# Altium project JacdacBrainNRF 57.PrjPCB
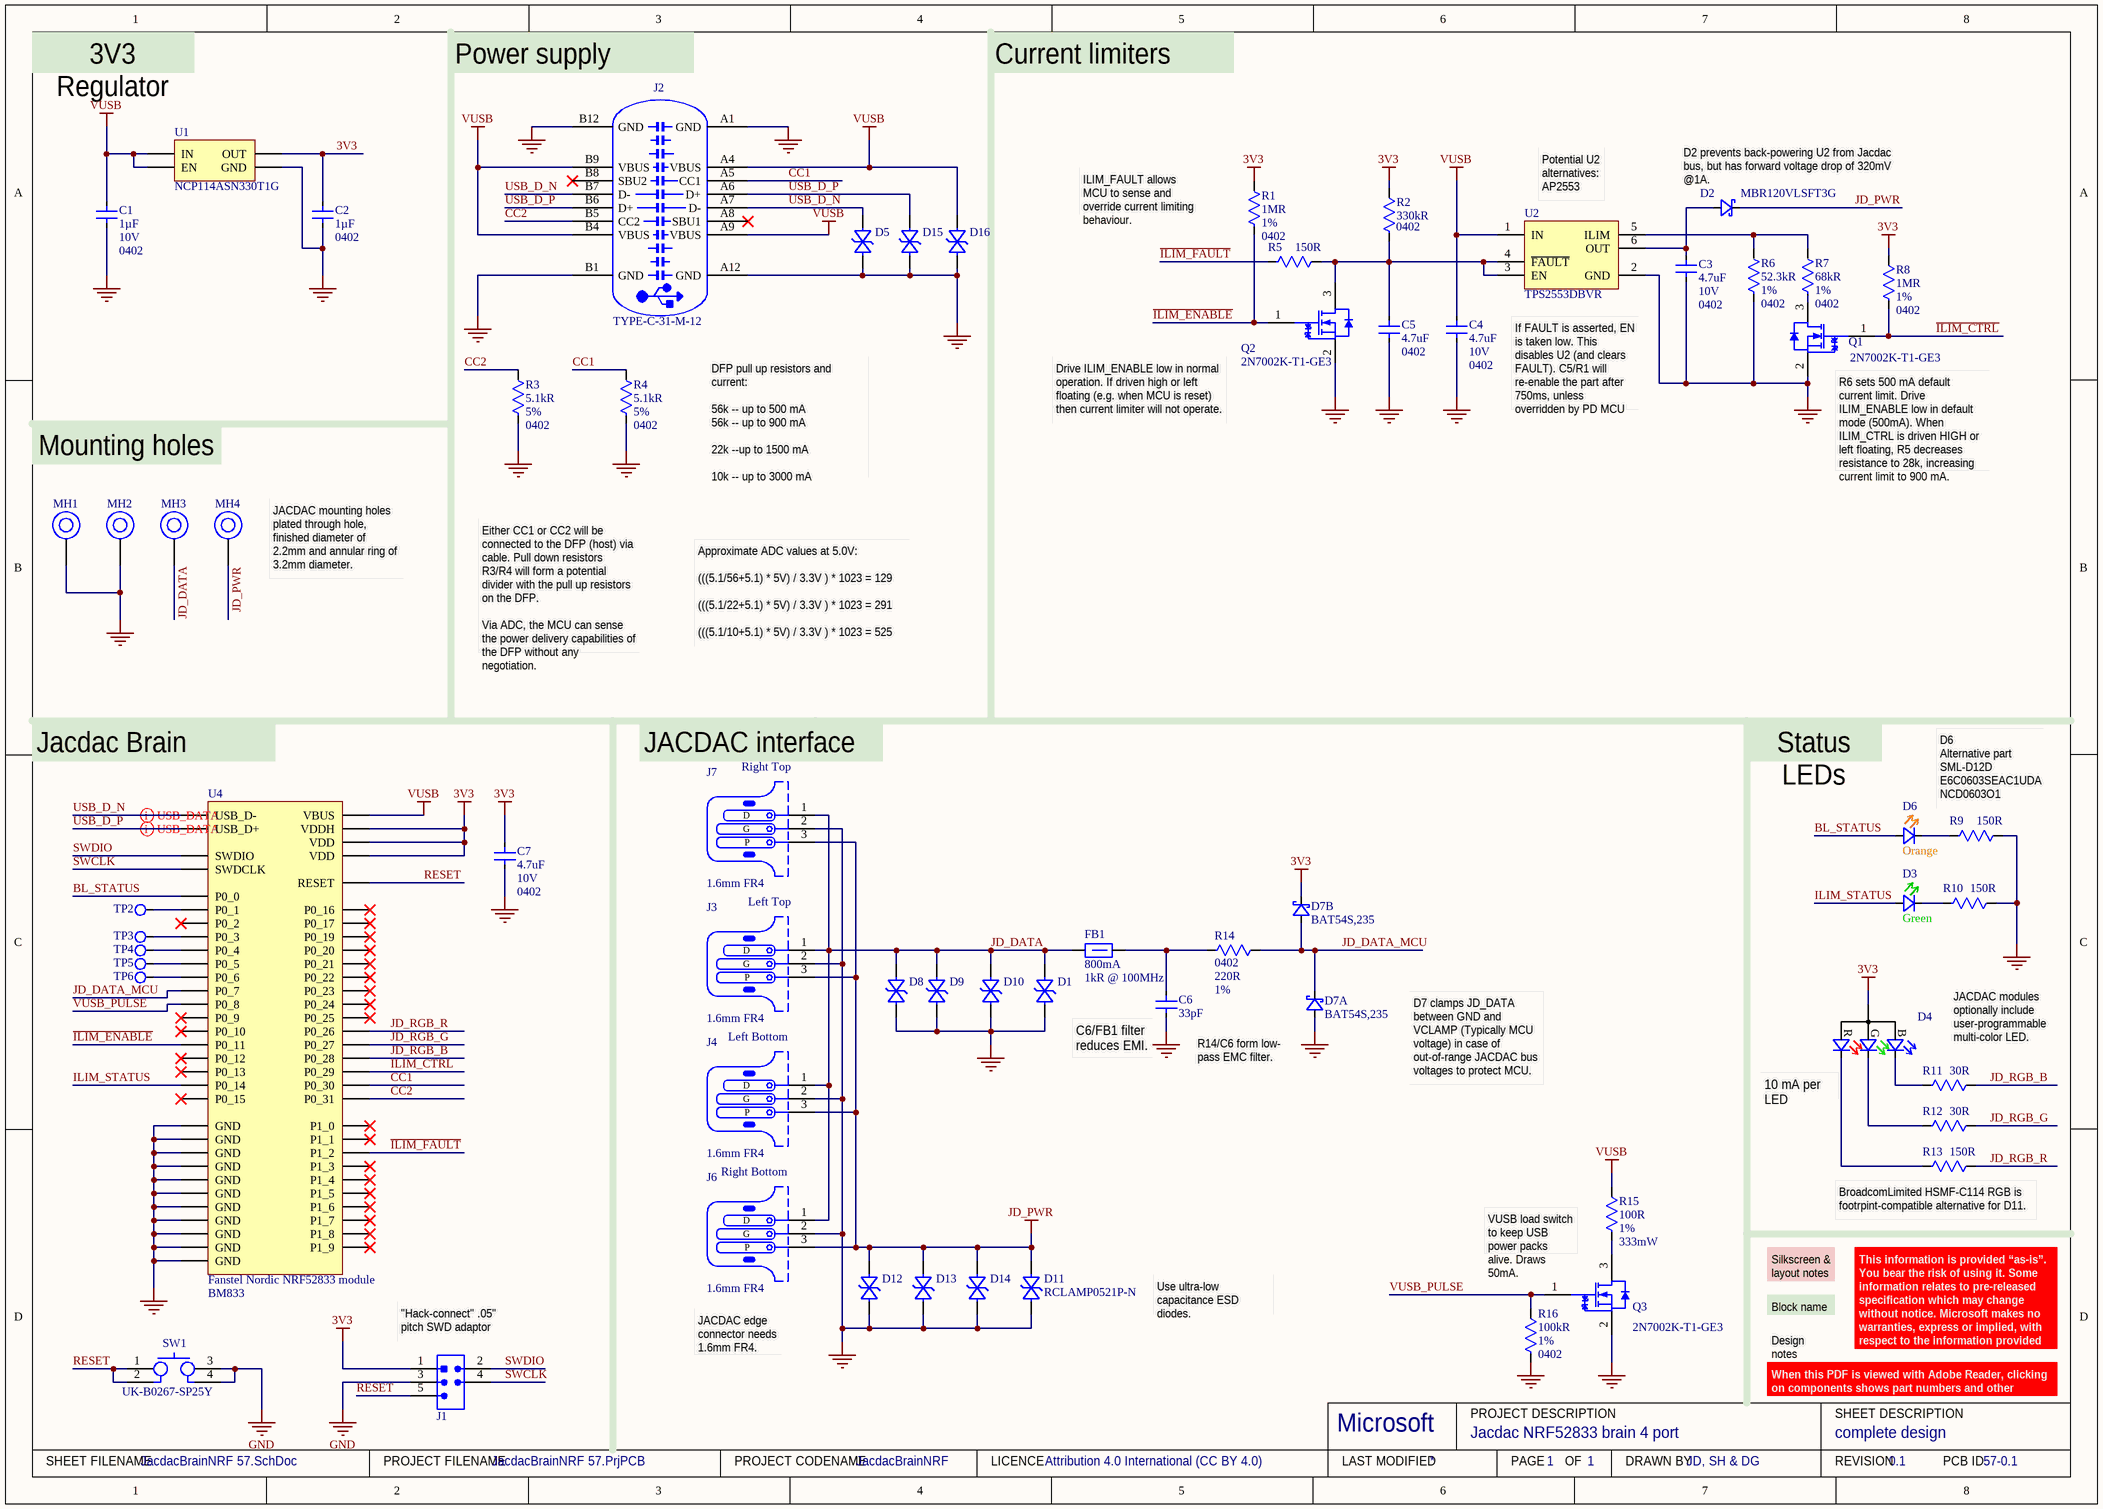
[diagram p0: JacdacBrainNRF 57.SchDoc]
ProjectCodeName: JacdacBrainNRF; ProjectCodenameDescription: Jacdac NRF52833 brain 4 port; ProjectCodenameID: 57; ProjectDrawnBy: JD, SH & DG; ProjectLicenceTerms: Attribution 4.0 International (CC BY 4.0); ProjectRevision: 0.1
1 sheet, 62 parts. Net scope: global (net labels, ports and power ports of the same name join across sheets).
Board files: JacdacBrainNRF 57.PcbDoc, Panelized JacdacBrainNRF 57.PcbDoc

## Sheet JacdacBrainNRF 57.SchDoc: complete design
size A3; DrawnBy: JD, SH & DG; DocumentNumber: 1; Revision: 0.1; SheetNumber: 1; SheetTotal: 1; VersionControl_RevNumber: 1

### Parts
C1  Capacitance: 1µF  Voltage Rating: 10V  Case Code (Imperial): 0402  [C0402_0.55MM - without outline]  (hidden comment: CL05A105KP5NNNC)
C2  Capacitance: 1µF  Case Code (Imperial): 0402  [C0402_0.55MM - without outline]  (hidden comment: CL05A105KP5NNNC)
C3  Capacitance: 4.7uF  Voltage Rating: 10V  Case Code (Imperial): 0402  [R0402 - Without outline]  (hidden comment: CL05A475MP5NRNC)
C4  Capacitance: 4.7uF  Voltage Rating: 10V  Case Code (Imperial): 0402  [R0402 - Without outline]  (hidden comment: CL05A475MP5NRNC)
C5  Capacitance: 4.7uF  Case Code (Imperial): 0402  [R0402 - Without outline]  (hidden comment: CL05A475MP5NRNC)
C6  Capacitance: 33pF  [C0402_0.55MM - without outline]  (hidden comment: CL05C330JB51PNC)
C7  Capacitance: 4.7uF  Voltage Rating: 10V  Case Code (Imperial): 0402  [R0402 - Without outline]  (hidden comment: CL05A475MP5NRNC)
D1  RCLAMP0521P-N  [TVS 0402 - L]  (value not drawn)
D2  MBR120VLSFT3G  [MBR120VLSFT3G]
D3  Colour: Green  [0603 Green]  (hidden comment: 19-217/GHC-YR1S2/3T)
D4  TZ-P4-1615RGBTCA1-0.55T  [TZ-P4-1615RGBTCA1-0.55T]  (value not drawn)
D5  RCLAMP0521P-N  [TVS 0402 - L]  (value not drawn)
D6  Colour: Orange  [0603 Orange]  (hidden comment: 19-217/S2C-AQ1R1B/3T)
D7  Manufacturer Part Number: BAT54S,235  [NXP-BAT54S-TO-236AB]  (hidden comment: BAT54S)  (parts A,B of 2)
D8  RCLAMP0521P-N  [TVS 0402 - L]  (value not drawn)
D9  RCLAMP0521P-N  [TVS 0402 - L]  (value not drawn)
D10  RCLAMP0521P-N  [TVS 0402 - L]  (value not drawn)
D11  RCLAMP0521P-N  [TVS 0402 - L]
D12  RCLAMP0521P-N  [TVS 0402 - L]  (value not drawn)
D13  RCLAMP0521P-N  [TVS 0402 - L]  (value not drawn)
D14  RCLAMP0521P-N  [TVS 0402 - L]  (value not drawn)
D15  RCLAMP0521P-N  [TVS 0402 - L]  (value not drawn)
D16  RCLAMP0521P-N  [TVS 0402 - L]  (value not drawn)
FB1  Current Rating: 800mA  Impedance: 1kR @ 100MHz  [TDK MPZ1608 0.8mm - without outline]  (hidden comment: TDK MPZ1608S102ATA00)
J1  Hack Connect Mini 1.27 mm pitch 2-row  [HACK_CONNECT_MINI_5_X_1_27]  (value not drawn)  (no BOM)
J2  TYPE-C-31-M-12  [TYPE-C-31-M-12]
J3  PCB Type: 1.6mm FR4  [JACDAC_EDGE_CONNECTOR_NO_TRACES]  (hidden comment: 3 pin JACDAC edge connector)  (no BOM)
J4  PCB Type: 1.6mm FR4  [JACDAC_EDGE_CONNECTOR_NO_TRACES]  (hidden comment: 3 pin JACDAC edge connector)  (no BOM)
J6  PCB Type: 1.6mm FR4  [JACDAC_EDGE_CONNECTOR_NO_TRACES]  (hidden comment: 3 pin JACDAC edge connector)  (no BOM)
J7  PCB Type: 1.6mm FR4  [JACDAC_EDGE_CONNECTOR_NO_TRACES]  (hidden comment: 3 pin JACDAC edge connector)  (no BOM)
MH1  MH_5.0MMK_3.0MMC_2.1MMD_PTH  [MH_5.0MMK_3.0MMC_2.1MMD_PTH]  (value not drawn)  (no BOM)
MH2  MH_5.0MMK_3.0MMC_2.1MMD_PTH  [MH_5.0MMK_3.0MMC_2.1MMD_PTH]  (value not drawn)  (no BOM)
MH3  MH_5.0MMK_3.0MMC_2.1MMD_PTH  [MH_5.0MMK_3.0MMC_2.1MMD_PTH]  (value not drawn)  (no BOM)
MH4  MH_5.0MMK_3.0MMC_2.1MMD_PTH  [MH_5.0MMK_3.0MMC_2.1MMD_PTH]  (value not drawn)  (no BOM)
Q1  2N7002K-T1-GE3  [SOT-23-3 (TO-236)]
Q2  2N7002K-T1-GE3  [SOT-23-3 (TO-236)]
Q3  2N7002K-T1-GE3  [SOT-23-3 (TO-236)]
R1  Resistance: 1MR  Tolerance: 1%  Case Code (Imperial): 0402  [R0402 - Without outline]
R2  Resistance: 330kR  Size Code: 0402  [R0402 - Without outline]  (hidden comment: RC0402FR-07330KL)
R3  Resistance: 5.1kR  Tolerance: 5%  Case Code (Imperial): 0402  [R0402 - Without outline]  (hidden comment: RC0402JR-075K1L)
R4  Resistance: 5.1kR  Tolerance: 5%  Case Code (Imperial): 0402  [R0402 - Without outline]  (hidden comment: RC0402JR-075K1L)
R5  Resistance: 150R  [R0402 - Without outline]  (hidden comment: RC0402FR-07150RL)
R6  Resistance: 52.3kR  Tolerance: 1%  Case Code (Imperial): 0402  [R0402 - Without outline]  (hidden comment: RC0402FR-0752K3L)
R7  Resistance: 68kR  Tolerance: 1%  Case Code (Imperial): 0402  [R0402 - Without outline]  (hidden comment: RT0402FRE0768KL)
R8  Resistance: 1MR  Tolerance: 1%  Case Code (Imperial): 0402  [R0402 - Without outline]
R9  Resistance: 150R  [R0402 - Without outline]  (hidden comment: RC0402FR-07150RL)
R10  Resistance: 150R  [R0402 - Without outline]  (hidden comment: RC0402FR-07150RL)
R11  Resistance: 30R  [R0402 - Without outline]  (hidden comment: RC0402FR-0730RL)
R12  Resistance: 30R  [R0402 - Without outline]  (hidden comment: RC0402FR-0730RL)
R13  Resistance: 150R  [R0402 - Without outline]  (hidden comment: RC0402FR-07150RL)
R14  Case Code (Imperial): 0402  Resistance: 220R  Tolerance: 1%  [R0402 - Without outline]  (hidden comment: RC0402FR-07220RL)
R15  Resistance: 100R  Tolerance: 1%  Max Power Dissipation: 333mW  [RES0805]  (hidden comment: CRGP0805F100R)
R16  Resistance: 100kR  Tolerance: 1%  Case/Package: 0402  [R0402 - Without outline]  (hidden comment: RC0402FR-07100KL)
SW1  UK-B0267-SP25Y  [USAKRO-UK-B0267-SP25Y]
TP2  TestPoint  [Pad1.27mm]  (value not drawn)  (no BOM)
TP3  TestPoint  [Pad1.27mm]  (value not drawn)  (no BOM)
TP4  TestPoint  [Pad1.27mm]  (value not drawn)  (no BOM)
TP5  TestPoint  [Pad1.27mm]  (value not drawn)  (no BOM)
TP6  TestPoint  [Pad1.27mm]  (value not drawn)  (no BOM)
U1  LDO 3.3V/300 mA  [ON_SEMI-SOT23-5 - without outline]  (value not drawn)
U2  TPS2553DBVR  [TI-TPS2553]
U4  Fanstel Nordic NRF52833 module  [BM833]

### Nets
3V3: C2.2 C7.2 D4.1(A) D7.2(K) J1.1(VCC) R1.1 R2.1 R8.1 U1.5(OUT) U4.14(VDD) U4.28(VDD) U4.56(VDDH)
GND: C1.1 C2.1 C3.1 C4.1 C5.1 C6.1 C7.1 D1.2(A) D5.2(A) D7.1(A) D8.2(A) D9.2(A) D10.2(A) D11.2(A) D12.2(A) D13.2(A) D14.2(A) D15.2(A) D16.2(A) J1.3(GND) J2.A1(GND) J2.A12(GND) J2.B1(GND) J2.B12(GND) J3.2(G) J4.2(G) J6.2(G) J7.2(G) MH1.1 MH2.1 Q1.2(S) Q2.2(S) Q3.2(S) R3.2 R4.2 R6.1 R9.2 R10.2 R16.1 SW1.3 SW1.4 U1.2(GND) U2.2(GND) U4.1(GND) U4.2(GND) U4.3(GND) U4.4(GND) U4.5(GND) U4.13(GND) U4.15(GND) U4.18(GND) U4.19(GND) U4.30(GND) U4.45(GND)
JD_PWR: D2.1(K) D11.1(K) D12.1(K) D13.1(K) D14.1(K) J3.3(P) J4.3(P) J6.3(P) J7.3(P) MH4.1
VUSB: C1.2 C4.2 D16.1(K) J2.A4(VBUS) J2.A9(VBUS) J2.B4(VBUS) J2.B9(VBUS) R15.2 U1.1(IN) U1.3(EN) U2.1(IN) U4.58(VBUS)
~{ILIM_CTRL}: Q1.1(G) R8.2 U4.10(P0_29)
~{ILIM_ENABLE}: Q2.1(G) R1.2 U4.34(P0_11)
~{ILIM_FAULT}: R5.1 U4.32(P1_2)
BL_STATUS: D6.2(A) U4.16(P0_0)
CC1: J2.A5(CC1) R4.1 U4.11(P0_30)
CC2: J2.B5(CC2) R3.1 U4.12(P0_31)
ILIM_STATUS: D3.2(A) U4.33(P0_14)
JD_DATA: D1.1(K) D8.1(K) D9.1(K) D10.1(K) FB1.1 J3.1(D) J4.1(D) J6.1(D) J7.1(D) MH3.1
JD_DATA_MCU: D7.3(K) R14.1 U4.24(P0_7)
JD_RGB_B: R11.2 U4.9(P0_28)
JD_RGB_G: R12.2 U4.8(P0_27)
JD_RGB_R: R13.2 U4.7(P0_26)
RESET: J1.5(RESET) SW1.1 SW1.2 U4.40(RESET)
SWCLK: J1.4(SWCLK) U4.42(SWDCLK)
SWDIO: J1.2(SWDIO) U4.43(SWDIO)
USB_D_N: D5.1(K) J2.A7(D-) J2.B7(D-) U4.68(USB_D-)
USB_D_P: D15.1(K) J2.A6(D+) J2.B6(D+) U4.67(USB_D+)
VUSB_PULSE: Q3.1(G) R16.2 U4.27(P0_8)
NetC3_2: C3.2 D2.2(A) U2.6(OUT)
NetC5_2: C5.2 Q2.3(D) R2.2 R5.2 U2.3(EN) U2.4(~{FAULT})
NetC6_2: C6.2 FB1.2 R14.2
NetD3_1: D3.1(K) R10.1
NetD4_2: D4.2(R) R13.1
NetD4_3: D4.3(G) R12.1
NetD4_4: D4.4(B) R11.1
NetD6_1: D6.1(K) R9.1
NetQ1_3: Q1.3(D) R7.1
NetQ3_3: Q3.3(D) R15.1
NetR6_2: R6.2 R7.2 U2.5(ILIM)
NetTP2_1: TP2.1 U4.17(P0_1)
NetTP3_1: TP3.1 U4.20(P0_3)
NetTP4_1: TP4.1 U4.21(P0_4)
NetTP5_1: TP5.1 U4.23(P0_5)
NetTP6_1: TP6.1 U4.25(P0_6)

Not connected (* = marked no-connect by the designer): J2 A8(SBU1)* B8(SBU2)*; U4 22(P0_2)* 26(P0_9)* 29(P0_10)* 31(P1_1)* 35(P0_15)* 36(P0_16)* 37(P0_17)* 38(P1_0)* 41(P0_13)* 44(P0_22)* 47(P0_24)* 48(P0_19)* 49(P1_3)* 51(P1_5)* 52(P1_9)* 53(P0_23)* 54(P1_8)* 55(P0_25)* 60(P0_21)* 61(P1_4)* 62(P0_20)* 64(P0_12)* 65(P1_6)* 66(P1_7)*

### Layout directives
differential pair; rule Signal Stimulus [Kind - Single Pulse    Level - High    Start Time = 0.000    Stop Time = 41.67n    Period Time = 83.33n]: USB_D_N
differential pair; rule Signal Stimulus [Kind - Single Pulse    Level - High    Start Time = 0.000    Stop Time = 500.0m    Period Time = 1.000]: USB_D_P

### Notes on the sheet
- 3V3 Regulator
- Power supply
- Current limiters
- (near D2) D2 prevents back-powering U2 from Jacdac bus, but has forward voltage drop of 320mV @1A.
- (near R1) ILIM_FAULT allows MCU to sense and override current limiting behaviour.
- (near U2) Potential U2 alternatives:
  AP2553
- Drive ILIM_ENABLE low in normal operation. If driven high or left floating (e.g. when MCU is reset) then current limiter will not operate.
- If FAULT is asserted, EN is taken low. This disables U2 (and clears FAULT). C5/R1 will re-enable the part after 750ms, unless overridden by PD MCU
- Mounting holes
- DFP pull up resistors and current:
  56k -- up to 500 mA
  56k -- up to 900 mA
  22k --up to 1500 mA
  10k -- up to 3000 mA
- (near Q1) R6 sets 500 mA default current limit. Drive ILIM_ENABLE low in default mode (500mA). When ILIM_CTRL is driven HIGH or left floating, R5 decreases resistance to 28k, increasing current limit to 900 mA.
- (near MH4) JACDAC mounting holes  plated through hole, finished diameter of 2.2mm and annular ring of 3.2mm diameter.
- Either CC1 or CC2 will be connected to the DFP (host) via cable. Pull down resistors R3/R4 will form a potential divider with the pull up resistors on the DFP.
  Via ADC, the MCU can sense the power delivery capabilities of the DFP without any negotiation.
- Approximate ADC values at 5.0V:
  (((5.1/56+5.1) * 5V) / 3.3V ) * 1023 = 129
  (((5.1/22+5.1) * 5V) / 3.3V ) * 1023 = 291
  (((5.1/10+5.1) * 5V) / 3.3V ) * 1023 = 525
- Jacdac Brain
- JACDAC interface
- (near J7) Right Top
- Status LEDs
- D6
  Alternative part
  SML-D12D
  E6C0603SEAC1UDA
  NCD0603O1
- Left Top
- Left Bottom
- (near C6) C6/FB1 filter reduces EMI.
- JACDAC modules optionally include user-programmable multi-color LED.
- R14/C6 form low-
  pass EMC filter.
- D7 clamps JD_DATA between GND and VCLAMP (Typically MCU voltage) in case of out-of-range JACDAC bus voltages to protect MCU.
- (near D4) 10 mA per LED
- Right Bottom
- VUSB load switch to keep USB power packs alive. Draws 50mA.
- (near R13) BroadcomLimited HSMF-C114 RGB is footrpint-compatible alternative for D11.
- Use ultra-low capacitance ESD diodes.
- Block name
- Silkscreen & layout notes
- (near J1) "Hack-connect" .05" pitch SWD adaptor
- JACDAC edge connector needs 1.6mm FR4.
- Design notes
- When this PDF is viewed with Adobe Reader, clicking on components shows part numbers and other details.
- This information is provided “as-is”. You bear the risk of using it. Some information relates to pre-released specification which may change without notice. Microsoft makes no warranties, express or implied, with respect to the information provided here.
- Microsoft
- PROJECT DESCRIPTION
- SHEET DESCRIPTION
- SHEET FILENAME
- PROJECT FILENAME
- PROJECT CODENAME
- LICENCE
- LAST MODIFIED
- PAGE
- OF
- DRAWN BY
- REVISION
- PCB ID

### Library data of the parts
C1 C2 = CL05A105KP5NNNC: CAP CER 1UF 10V X5R 0402; Manufacturer: Samsung; Material: Ceramic; Tolerance: 10%; Supplier 1: Digi-Key; Manufacturer Part Number: CL05A105KP5NNNC; RoHS: Yes; Category: Capacitors; Stock 1: 5705569; Pricing 1: 1=0.10000, 10=0.03900, 50=0.02100, 100=0.01720, 500=0.01228, 1000=0.00965, 2500=0.00877, 5000=0.00807 (USD); Mount: Surface Mount; Case/Package: 0402; Case Code (Metric): 1005; Contact Plating: Tin; Min Operating Temperature: -55°C; Max Operating Temperature: 85°C; Dielectric: X5R; Package Quantity: 1; Packaging: Tape and Reel; Length: 1mm; Height: 0.5mm; Width: 0.02inch; Thickness: 0.022inch; Depth: 0.5mm; Radiation Hardening: No; ComponentLink1URL: https://datasheet.ciiva.com/15195/getdatasheetpartid-358390-15195630.pdf; ComponentLink1Description: Online datasheet; Supplier 2: Mouser; Stock 2: 928941; Pricing 2: 1=0.10000, 10=0.04200, 100=0.01800, 500=0.01300, 1000=0.01000, 2500=0.00900 (USD); Supplier 3: Farnell; Stock 3: 53670; Pricing 3: 10=0.02450, 100=0.02000, 500=0.01310, 2500=0.00920, 5000=0.00810, 10000=0.00640, 50000=0.00490 (GBP); Supplier Part Number 3: 3013329; Supplier Part Number 2: 187-CL05A105KP5NNNC; Supplier Part Number 1: 1276-1076-1-ND; Created: DG; Checked: ?
  C2: Voltage Rating: 10V
C3-C5 C7 = CL05A475MP5NRNC: CAP CER 4.7UF 10V X5R 0402; Manufacturer: Samsung; Tolerance: 20%; Supplier 1: Digi-Key; Manufacturer Part Number: CL05A475MP5NRNC; RoHS: Yes; Category: Ceramic Capacitors; Stock 1: 840000; Pricing 1: 10000=0.01405, 20000=0.01338 (USD); Mount: Surface Mount; Case/Package: 0402; Case Code (Metric): 1005; Min Operating Temperature: -55°C; Max Operating Temperature: 85°C; Package Quantity: 10000; Packaging: Tape and Reel; Dielectric: X5R; Series: CL; Length: 0.039inch; Width: 0.02inch; Thickness: 0.022inch; Lead Free: Lead Free; RoHS Compliant: Yes; ComponentLink1URL: https://datasheet.ciiva.com/25786/cl05a475mp5nrnc-25786963.pdf; ComponentLink1Description: Online datasheet; Supplier 2: Future Electronics; Stock 2: 2004; Pricing 2: 1=0.23500, 500=0.03970, 1500=0.02900, 2500=0.02500, 5000=0.02050 (USD); Created By: D. Gakure; Checked By: ?; Supplier Part Number 2: 2103694; Supplier Part Number 1: 1276-1482-2-ND
  C5: Voltage Rating: 10V
C6 = CL05C330JB51PNC: CAP CER 33PF 50V NP0 0402; Manufacturer: Samsung; Tolerance: 5%; Supplier 1: Digi-Key; Manufacturer Part Number: CL05C330JB51PNC; RoHS: Yes; Category: Capacitors; Stock 1: 250654; Pricing 1: 1=0.10000, 10=0.07500, 50=0.04060, 100=0.03320, 500=0.02374, 1000=0.01865, 2500=0.01696, 5000=0.01560 (USD); Mount: Surface Mount; Case/Package: 0402; Case Code (Metric): 1005; Min Operating Temperature: -55°C; Max Operating Temperature: 125°C; Packaging: Tape and Reel; Length: 0.039inch; Width: 0.02inch; Thickness: 0.022inch; Ratings: AEC-Q200; Lead Free: Lead Free; ComponentLink1URL: http://www.samsungsem.com/kr/support/library/product-catalog/mlcc.jsp; ComponentLink1Description: Samsung datasheet online; Supplier 2: Mouser; Stock 2: 97900; Pricing 2: 1=0.11000, 10=0.08200, 100=0.03600, 500=0.02600, 1000=0.02000, 2500=0.01800 (USD); Supplier 3: Future Electronics; Stock 3: 100000; Pricing 3: 10000=0.00780 (USD); Supplier Part Number 3: 6022520; Supplier Part Number 2: 187-CL05C330JB51PNC; Checked: ?; Created: DG; Supplier Part Number 1: 1276-6515-1-ND; Voltage Rating: 50V; Case Code (Imperial): 0402
D1 D5 D8-D16 = RCLAMP0521P-N: Bidirectional 5V (Max) 6V 16V 3.5A (8/20us) 0402 TVS RoHS; Manufacturer: Born Semiconductor; Package: 0402; Created By: D Gakure; Checked By: ?; Supplier1: LCSC; Supplier1 Part Number: C316043; ComponentLink1Description: Online datasheet; ComponentLink1URL: https://datasheet.lcsc.com/szlcsc/Bourne-Semicon-Shenzhen-RCLAMP0521P-N_C316043.pdf; Manufacturer Part Number: RCLAMP0521P-N
D2 = MBR120VLSFT3G: DIODE SCHOTTKY 20V 1A SOD123FL; Manufacturer: ON Semiconductor; Max Surge Current: 45A; Forward Voltage: 340mV; Peak Reverse Current: 600uA; Element Configuration: Single; Polarity: Standard; Supplier 1: Digi-Key; RoHS: Yes; Category: Schottky Diodes; Stock 1: 32481; Pricing 1: 1=0.39000, 10=0.28600, 100=0.19920, 500=0.12616, 1000=0.10292, 2000=0.09960, 5000=0.09628 (USD); Number of Pins: 2; Min Operating Temperature: -65°C; Max Operating Temperature: 125°C; Package Quantity: 10000; Forward Current: 1A; Packaging: Tape and Reel; Max Reverse Leakage Current: 600uA; Average Rectified Current: 1A; Peak Non-Repetitive Surge Current: 45A; Max Repetitive Reverse Voltage (Vrrm): 20V; Max Forward Surge Current (Ifsm): 45A; Voltage Rating (DC): 20V; Current Rating: 1A; Output Current: 1A; Max Reverse Voltage (DC): 20V; Radiation Hardening: No; REACH SVHC: No SVHC; Lead Free: Lead Free; Halogen Free: Halogen Free; ComponentLink4URL: https://datasheet.ciiva.com/6380/mbr120vlsft1-d-6380910.pdf; ComponentLink4Description: On Semi datasheet online; Supplier 2: Mouser; Supplier 3: RSComponents; Supplier Part Number 3: 1867479; Supplier Part Number 2: 863-MBR120VLSFT3G; Supplier Part Number 1: MBR120VLSFT3GOSCT-ND; Manufacturer Part Number: MBR120VLSFT3G
D3 = 19-217/GHC-YR1S2/3T: LED GREEN DIFFUSED 0603 SMD; Manufacturer: Everlight Elec; Manufacturer Part Number: 19-217/GHC-YR1S2/3T; Mount: Surface Mount; Case/Package: 0603; Color: Green; Case Code (Imperial): 0603; ComponentLink1URL: https://datasheet.lcsc.com/lcsc/1811101510_Everlight-Elec-19-217-GHC-YR1S2-3T_C72043.pdf; ComponentLink1Description: Online datasheet; Supplier 1: LCSC; Supplier 1 Part Number: C72043
D4 = TZ-P4-1615RGBTCA1-0.55T: 1615 Light Emitting Diodes (LED) RoHS; Manufacturer: TUOZHAN; Manufacturer Part Number: TZ-P4-1615RGBTCA1-0.55T; Category: Optoelectronics; Package: 1615; ComponentLink1Description: Online datasheet; ComponentLink1URL: https://datasheet.lcsc.com/szlcsc/2009041238_TUOZHAN-TZ-P4-1615RGBTCA1-0-55T_C779813.pdf; RoHS: RoHS Compliant; Supplier 1: LCSC; Size / Dimension: 1.6x1.5mm; Supplier 1 Part Number: C779813; Packaging: Tape & Reel (TR); Created By: D. Gakure; Checked By: ?
D6 = 19-217/S2C-AQ1R1B/3T: LED ORANGE DIFFUSED 0603 SMD; Manufacturer: Everlight Elec; Manufacturer Part Number: 19-217/S2C-AQ1R1B/3T; Mount: Surface Mount; Case/Package: 0603; Color: Orange; Case Code (Imperial): 0603; ComponentLink1URL: https://datasheet.lcsc.com/lcsc/1912171731_Everlight-Elec-19-217-S2C-AQ1R1B-3T_C146215.pdf; ComponentLink1Description: Online datasheet; Supplier 1: LCSC; Supplier 1 Part Number: C146215
D7 = BAT54S: DIODE ARRAY SCHOTTKY 30V SOT23; Manufacturer: Nexperia; Supplier 1: Digi-Key; RoHS: No; Category: Rectifier Diodes; Stock 1: 14011; Pricing 1: 1=0.13000, 10=0.11900, 100=0.05610, 500=0.03326, 1000=0.02185, 5000=0.02138 (USD); ComponentLink1URL: https://assets.nexperia.com/documents/data-sheet/BAT54_SER.pdf; ComponentLink1Description: NXP datasheet online; Supplier 2: Mouser; Supplier 3: RSComponents; Supplier Part Number 2: 771-BAT54S235; Supplier Part Number 3: 1707990; Supplier Part Number 1: 1727-1868-1-ND
FB1 = TDK MPZ1608S102ATA00: 0603 1k@100MHz 0.8A chip; Core Material: Ferrite; Tolerance: 25%; DC Resistance (DCR): 300mR; Supplier 1: Digi-Key; Stock 1: 113542; Pricing 1: 1=0.1, 10=0.079, 25=0.0716, 50=0.0644, 100=0.0472, 250=0.03432, 500=0.03146, 1000=0.02717 (USD); Mount: Surface Mount; Case/Package: 0603; Case Code (Metric): 1608; Case Code (Imperial): 0603; Package Quantity: 4000; Packaging: Tape and Reel; Max DC Current: 800mA; Length: 0.063inch; Height: 0.037inch; Width: 0.031inch; ComponentLink2URL: https://www.mouser.co.uk/datasheet/2/400/eads_commercial_power_mpz1608_en-923650.pdf; ComponentLink2Description: datasheet online; Supplier 2: Mouser; ComponentLink3Description: datasheet; ComponentLink3URL: Y:\System\Altium\Libraries 2014\TDK\Datasheets\eads_commercial_power_mpz1608_en-923650.pdf; Supplier Part Number 1: 445-8694-1-ND; Supplier Part Number 2: 810-MPZ1608S102ATA00; Manufacturer: TDK; Manufacturer Part Number: MPZ1608S102ATA00
J1 = HACK_CONNECT_MINI
J2 = TYPE-C-31-M-12: USB - Type C Female 16 USB Connectors RoHS; Manufacturer: Korean Hroparts Elec; Gender: Receptacle; Number of Positions: 16; RoHS: Yes; Category: USB Connectors; Orientation: Right Angle; ComponentLink1URL: https://datasheet.lcsc.com/szlcsc/1811131825_Korean-Hroparts-Elec-TYPE-C-31-M-12_C165948.pdf; ComponentLink1Description: Online datasheet; Supplier 1 Part Number: C165948; Supplier 1: LCSC; Manufacturer Part Number: TYPE-C-31-M-12
J3 J4 J6 J7 = Jacdac edge connector: 3 pin Jacdac edge connector 1.27mm pitch; Manufacturer Part Number: JACDAC_EDGE_CONNECTOR; Checked By: ?; Created By: D. Gakure; ComponentLink1Description: Yuliang JACDAC cable connector drawing online; ComponentLink1URL: https://github.com/microsoft/jacdac-mdk/blob/main/connector/JACDAC-Connector-by-Yuliang-2020-11-28.pdf; ComponentLink2Description: JACDAC PCB edge connector spec onlin; ComponentLink2URL: https://github.com/microsoft/jacdac-mdk/blob/main/connector/JACDAC_PCB_Edge_Connector_Drawing_JD-PEC-01_rev_01.pdf
MH1-MH4 = MH_5.0MMK_3.0MMC_2.1MMD_PTH: Mounting Hole 5.0mm keepout, 3.0mm annualar ring and 2.1mm Drill PTH
Q1-Q3 = 2N7002K-T1-GE3: Trans MOSFET N-CH Si 60V 0.3A 3-Pin SOT-23 T/R; Manufacturer: Vishay; Rds On Max: 2R; Input Capacitance: 30pF; Max Power Dissipation: 350mW; Continuous Drain Current (ID): 300mA; Element Configuration: Single; Nominal Vgs: 2V; Number of Elements: 1; Gate to Source Voltage (Vgs): 20V; Turn-Off Delay Time: 35ns; Threshold Voltage: 1V; Turn-On Delay Time: 25ns; Supplier 1: Digi-Key; RoHS: Yes; Category: MOSFETs; Pricing 1: 1=0.27000, 10=0.21800, 25=0.18200, 100=0.11540, 500=0.07590, 1000=0.05161 (USD); Mount: Surface Mount; Case/Package: SOT-23; Number of Pins: 3; Contact Plating: Tin,Matte; Weight: 0.050717oz; Min Operating Temperature: -55°C; Max Operating Temperature: 150°C; Packaging: Tape and Reel; Drain to Source Voltage (Vdss): 60V; On-State Resistance: 2R; Voltage: 60V; Package Quantity: 1; Number of Channels: 1; Drain to Source Breakdown Voltage: 60V; Drain to Source Resistance: 2R; Power Dissipation: 350mW; Length: 3.04mm; Width: 1.4mm; Height: 1.02mm; Radiation Hardening: No; Lead Free: Lead Free; REACH SVHC: Unknown; ComponentLink1URL: https://datasheet.ciiva.com/2957/2n7002k-2957216.pdf; ComponentLink1Description: Online datasheet; Supplier 2: RSComponents; Stock 2: 1; Pricing 2: 100=0.11100 (USD); Supplier Part Number 1: 2N7002K-T1-GE3CT-ND; Supplier Part Number 2: 7879058P; Manufacturer Part Number: 2N7002K-T1-GE3
R1 R8 = RC0402FR-071ML: RES SMD 1M OHM 1% 1/16W 0402; Manufacturer: Yageo; Power Rating: 63mW; Voltage Rating: 50V; Temperature Coefficient: 100ppm/°C; Supplier 1: Digi-Key; Manufacturer Part Number: RC0402FR-071ML; RoHS: Yes; Category: Chip SMD Resistors; Stock 1: 7856490; Pricing 1: 1=0.10000, 10=0.01600, 100=0.00640, 1000=0.00286, 2500=0.00248, 5000=0.00205 (USD); Case/Package: 0402; Case Code (Metric): 1005; Size Code: 0402; Min Operating Temperature: -55°C; Max Operating Temperature: 155°C; Resistor Type: Thick Film; Packaging: Tape and Reel; Termination: SMD/SMT; Features: Moisture Resistant; Series: RC; Max Power Dissipation: 63mW; Number of Terminations: 2; Resistance Tolerance: 1%; Construction: Rectangular; Technology: THICK FILM; Length: 1mm; Height: 0.32mm; Depth: 0.5mm; RoHS Compliant: Yes; REACH SVHC: Unknown; Military Standard: Not; Lead Free: Lead Free; ComponentLink1URL: https://datasheet.ciiva.com/11808/0900766b80c66297-11808125.pdf; ComponentLink1Description: Online datasheet; Supplier 2: Mouser; Stock 2: 1194490; Pricing 2: 1=0.10000, 10=0.01200, 50=0.01200, 100=0.00400, 1000=0.00400, 10000=0.00300 (USD); Supplier 3: Farnell; Stock 3: 1530000; Pricing 3: 10000=0.00290, 50000=0.00200 (GBP); Created By: D. Gakure; Supplier Part Number 2: 603-RC0402FR-071ML; Supplier Part Number 1: 311-1.00MLRCT-ND; Checked By: ?; Supplier Part Number 3: 2421892
R2 = RC0402FR-07330KL: RES SMD 330K OHM 1% 1/16W 0402; Manufacturer: Yageo; Power Rating: 63mW; Voltage Rating: 50V; Temperature Coefficient: 100ppm/°C; Supplier 1: Digi-Key; Manufacturer Part Number: RC0402FR-07330KL; RoHS: Yes; Category: Chip SMD Resistors; Stock 1: 78809; Pricing 1: 1=0.10000, 10=0.01600, 100=0.00660, 1000=0.00299, 2500=0.00259, 5000=0.00214 (USD); Case/Package: 0402; Case Code (Metric): 1005; Case Code (Imperial): 0402; Min Operating Temperature: -55°C; Max Operating Temperature: 155°C; Package Quantity: 1; Packaging: Tape and Reel; Resistor Type: Thick Film; Number of Terminations: 2; Termination: SMD/SMT; Max Power Dissipation: 63mW; Features: Moisture Resistant; Series: RC; Resistance Tolerance: 1%; Construction: Rectangular; Length: 1mm; Width: 0.02inch; Height: 0.016inch; Depth: 0.5mm; REACH SVHC: Unknown; Military Standard: Not; Lead Free: Lead Free; RoHS Compliant: Yes; ComponentLink1URL: https://datasheet.ciiva.com/2518/pyu-r-int-thick-7-2518994.pdf?src-supplier=Digi-Key; ComponentLink1Description: Online datasheet; Supplier 2: Mouser; Stock 2: 218637; Pricing 2: 1=0.10000, 10=0.01400, 50=0.01400, 100=0.00500, 1000=0.00300, 10000=0.00200 (USD); Supplier 3: Farnell; Stock 3: 310234; Pricing 3: 10=0.01210, 100=0.00460, 500=0.00410, 2500=0.00310, 5000=0.00280, 10000=0.00250, 50000=0.00180 (GBP); Supplier Part Number 2: 603-RC0402FR-07330KL; Supplier Part Number 1: 311-330KLRCT-ND; Supplier Part Number 3: 9239537; Created By: D Gakure; Tolerance: 1%; Checked By: ?
R3 R4 = RC0402JR-075K1L: RES SMD 5.1K OHM 5% 1/16W 0402; Manufacturer: Yageo; Voltage Rating: 50V; Power Rating: 62.5mW; Temperature Coefficient: 100ppm/°C; Max Power Dissipation: 63mW; Supplier 1: Digi-Key; Manufacturer Part Number: RC0402JR-075K1L; RoHS: Yes; Category: Chip SMD Resistors; Stock 1: 1270619; Pricing 1: 1=0.10000, 10=0.01300, 100=0.00520, 1000=0.00233, 2500=0.00202, 5000=0.00167 (USD); Case/Package: 0402; Case Code (Metric): 1005; Weight: 2.3E-05oz; Size Code: 0402; Min Operating Temperature: -55°C; Max Operating Temperature: 155°C; Packaging: Tape and Reel; Resistor Type: Thick Film; Termination: SMD/SMT; Voltage Rating (DC): 50V; Features: Moisture Resistant; Series: RC; Number of Terminations: 2; Construction: Rectangular; Resistance Tolerance: 5%; Length: 1mm; Width: 0.5mm; Height: 0.35mm; Depth: 0.5mm; REACH SVHC: No SVHC; Military Standard: Not; Lead Free: Lead Free; RoHS Compliant: Yes; ComponentLink2URL: https://datasheet.ciiva.com/16740/pyu-rc0402-51-rohs-l-6-r-16740925.pdf; ComponentLink2Description: Onnline datasheet; Supplier 2: Newark; Stock 2: 1265; Pricing 2: 1=0.10000, 25=0.01000, 100=0.00400, 250=0.00400, 500=0.00300, 1000=0.00300 (USD); Supplier 3: Mouser; Stock 3: 100817; Pricing 3: 1=0.10000, 10=0.01000, 50=0.01000, 100=0.00400, 1000=0.00300, 10000=0.00200 (USD); Supplier 4: Farnell; Stock 4: 68890; Pricing 4: 10=0.00910, 100=0.00390, 500=0.00320, 2500=0.00240, 5000=0.00210, 10000=0.00190, 50000=0.00150 (GBP); Supplier 5: Farnell; Stock 5: 1265; Pricing 5: 10000=0.00270 (GBP); Supplier Part Number 5: 1799293; Supplier Part Number 4: 3495714; Supplier Part Number 3: 603-RC0402JR-075K1L; Supplier Part Number 2: 68R0016; Supplier Part Number 1: 311-5.1KJRCT-ND; Created By: D. Gakure; Checked By: ?
R5 R9 R10 R13 = RC0402FR-07150RL: RES SMD 150 OHM 1% 1/16W 0402; Manufacturer: Yageo; Power Rating: 62.5mW; Voltage Rating: 50V; Temperature Coefficient: 100ppm/°C; Max Power Dissipation: 63mW; Supplier 1: Digi-Key; Manufacturer Part Number: RC0402FR-07150RL; RoHS: Yes; Category: Chip SMD Resistors; Stock 1: 5214533; Pricing 1: 1=0.10000, 10=0.01400, 100=0.00580, 1000=0.00260, 2500=0.00226, 5000=0.00186 (USD); Case/Package: 0402; Case Code (Metric): 1005; Min Operating Temperature: -55°C; Max Operating Temperature: 155°C; Packaging: Tape and Reel; Package Quantity: 1; Resistor Type: Thick Film; Number of Terminations: 2; Termination: SMD/SMT; Working Voltage: 50V; Features: Moisture Resistant; Series: RC; Resistance Tolerance: 1%; Construction: Rectangular; Technology: THICK FILM; Length: 1mm; Width: 0.02inch; Height: 0.016inch; Depth: 0.5mm; REACH SVHC: No SVHC; Military Standard: Not; Lead Free: Lead Free; RoHS Compliant: Yes; ComponentLink1URL: https://datasheet.ciiva.com/11808/0900766b80c66297-11808422.pdf; ComponentLink1Description: ine datasheet; Supplier 2: Mouser; Stock 2: 582717; Pricing 2: 1=0.10000, 10=0.01200, 50=0.01200, 100=0.00400, 1000=0.00400, 10000=0.00300 (USD); Supplier 3: Farnell; Stock 3: 880000; Pricing 3: 10000=0.00270, 50000=0.00200 (GBP); Created by: D. Gakure; Checked By: ?; Supplier Part Number 3: 2421893; Supplier Part Number 2: 603-RC0402FR-07150RL; Supplier Part Number 1: 311-150LRCT-ND; Tolerance: 1%; Case Code (Imperial): 0402
R6 = RC0402FR-0752K3L: RES SMD 52.3K OHM 1% 1/16W 0402; Manufacturer: Yageo; Temperature Coefficient: 100ppm/°C; Power Rating: 62.5mW; Voltage Rating: 50V; Max Power Dissipation: 63mW; Supplier 1: Digi-Key; Manufacturer Part Number: RC0402FR-0752K3L; RoHS: Yes; Category: Chip SMD Resistors; Stock 1: 1178310; Pricing 1: 1=0.10000, 10=0.01600, 100=0.00640, 1000=0.00286, 2500=0.00248, 5000=0.00205 (USD); Case/Package: 0402; Contact Plating: Tin,Matte; Weight: 2.3E-05oz; Min Operating Temperature: -55°C; Max Operating Temperature: 155°C; Resistor Type: Thick Film; Packaging: Tape and Reel; Number of Terminations: 2; Termination: SMD/SMT; Voltage Rating (DC): 50V; Features: Moisture Resistant; Series: RC; Construction: Rectangular; Length: 1mm; Width: 0.02inch; Height: 0.016inch; Depth: 0.5mm; Military Standard: Not; Lead Free: Lead Free; RoHS Compliant: Yes; ComponentLink1URL: https://datasheet.ciiva.com/16867/pyu-rc0402-51-rohs-l-6-16867930.pdf; ComponentLink1Description: Oline datasheet; Supplier 2: Mouser; Stock 2: 83620; Pricing 2: 1=0.10000, 10=0.01200, 50=0.01200, 100=0.00400, 1000=0.00300, 10000=0.00300 (USD); Created By: D. Gakure; Checked By: ?; Supplier Part Number 2: 603-RC0402FR-0752K3L; Supplier Part Number 1: YAG3179CT-ND; Size Code: 0402; Case Code (Metric): 1005
R7 = RT0402FRE0768KL: RES SMD 68K OHM 1% 1/16W 0402; Manufacturer: Yageo; Temperature Coefficient: 50ppm/°C; Power Rating: 62.5mW; Voltage Rating: 50V; Max Power Dissipation: 63mW; Supplier 1: Digi-Key; RoHS: Yes; Category: Chip SMD Resistors; Stock 1: 19319; Pricing 1: 1=0.10000, 10=0.07000, 100=0.02830, 1000=0.01272, 2500=0.01104, 5000=0.00912 (USD); Case/Package: 0402; Contact Plating: Tin,Matte; Case Code (Metric): 1005; Min Operating Temperature: -55°C; Max Operating Temperature: 125°C; Resistor Type: Thin Film; Package Quantity: 10000; Packaging: Tape and Reel; Number of Terminations: 2; Termination: SMD/SMT; Voltage Rating (DC): 50V; Series: RT; Length: 0.039inch; Width: 0.02inch; Height: 0.014inch; Radiation Hardening: No; Lead Free: Lead Free; RoHS Compliant: Yes; ComponentLink1URL: https://datasheet.ciiva.com/2561/pyu-rt-1-to-0-05-rohs-l-5-2561824.pdf?src-supplier=Digi-Key; ComponentLink1Description: Online datasheet; Supplier 2: Mouser; Stock 2: 28756; Pricing 2: 1=0.24000, 10=0.05600, 50=0.05600, 100=0.01900, 1000=0.01400, 10000=0.00800 (USD); Created By: D. Gakure; Checked By: ?; Supplier Part Number 2: 603-RT0402FRE0768KL; Supplier Part Number 1: 13-RT0402FRE0768KLCT-ND; Manufacturer Part Number: RT0402FRE0768KL
R11 R12 = RC0402FR-0730RL: RES SMD 30 OHM 1% 1/16W 0402; Manufacturer: Yageo; Temperature Coefficient: 100ppm/°C; Power Rating: 63mW; Voltage Rating: 50V; Supplier 1: Digi-Key; Manufacturer Part Number: RC0402FR-0730RL; RoHS: Yes; Category: Chip SMD Resistors; Stock 1: 2973; Pricing 1: 1=0.10000, 10=0.01400, 100=0.00580, 1000=0.00260, 2500=0.00226, 5000=0.00186 (USD); Case/Package: 0402; Contact Plating: Tin,Matte; Case Code (Metric): 1005; Size Code: 0402; Min Operating Temperature: -55°C; Max Operating Temperature: 155°C; Resistor Type: Thick Film; Packaging: Tape and Reel; Termination: SMD/SMT; Voltage Rating (DC): 50V; Features: Moisture Resistant; Series: RC; Max Power Dissipation: 63mW; Number of Terminations: 2; Construction: Rectangular; Resistance Tolerance: 1%; Length: 1mm; Width: 0.5mm; Height: 0.35mm; Depth: 0.5mm; REACH SVHC: Unknown; Military Standard: Not; Lead Free: Lead Free; RoHS Compliant: Yes; ComponentLink1URL: https://datasheet.ciiva.com/7849/1018594-7849958.pdf; ComponentLink1Description: Online datasheet; Supplier 2: Mouser; Stock 2: 41804; Pricing 2: 1=0.10000, 10=0.01200, 50=0.01200, 100=0.00400, 1000=0.00400, 10000=0.00300 (USD); Supplier 3: Farnell; Stock 3: 4422; Pricing 3: 10=0.01210, 100=0.00420, 500=0.00370, 2500=0.00280, 5000=0.00250, 10000=0.00230, 50000=0.00150 (GBP); Supplier Part Number 3: 1458775; Supplier Part Number 2: 603-RC0402FR-0730RL; Supplier Part Number 1: 311-30LRCT-ND; Created By: D. Gakure; Checked By: ?; Tolerance: 1%; Case Code (Imperial): 0402
R14 = RC0402FR-07220RL: RES SMD 220 OHM 1% 1/16W 0402; Manufacturer: Yageo; Power Rating: 62.5mW; Voltage Rating: 50V; Temperature Coefficient: 100ppm/°C; Max Power Dissipation: 63mW; Supplier 1: Digi-Key; Manufacturer Part Number: RC0402FR-07220RL; RoHS: Yes; Category: Resistors; Stock 1: 1286042; Pricing 1: 1=0.10000, 10=0.01400, 100=0.00580, 1000=0.00262, 2500=0.00228, 5000=0.00188 (USD); Case/Package: 0402; Number of Pins: 2; Case Code (Metric): 1005; Min Operating Temperature: -55°C; Max Operating Temperature: 155°C; Packaging: Tape and Reel; Voltage Rating (DC): 50V; Package Quantity: 1; Termination: SMD/SMT; Resistor Type: Thick Film; Number of Terminations: 2; Features: Moisture Resistant; Length: 1mm; Height: 0.016inch; Width: 0.02inch; Depth: 0.5mm; REACH SVHC: No SVHC; Military Standard: Not; Lead Free: Lead Free; ComponentLink1URL: https://datasheet.ciiva.com/11819/0900766b80c66297-11819466.pdf?src-supplier=RSComponents; ComponentLink1Description: https://datasheet.ciiva.com/11819/0900766b80c66297-11819466.pdf?src-supplier=RSComponents; ComponentLink2URL: https://datasheet.ciiva.com/2453/pyu-r-int-thick-7-2453460.pdf?src-supplier=Digi-Key; ComponentLink2Description: https://datasheet.ciiva.com/2453/pyu-r-int-thick-7-2453460.pdf?src-supplier=Digi-Key; ComponentLink3URL: https://datasheet.ciiva.com/2453/pyu-r-int-thick-7-2453461.pdf?src-supplier=Digi-Key; ComponentLink3Description: https://datasheet.ciiva.com/2453/pyu-r-int-thick-7-2453461.pdf?src-supplier=Digi-Key; ComponentLink4URL: https://datasheet.ciiva.com/2453/pyu-r-int-thick-7-2453462.pdf?src-supplier=Digi-Key; ComponentLink4Description: https://datasheet.ciiva.com/2453/pyu-r-int-thick-7-2453462.pdf?src-supplier=Digi-Key; ComponentLink5URL: https://datasheet.ciiva.com/16746/pyu-rc0402-51-rohs-l-6-r-16746831.pdf?src-supplier=Future+Electronics; ComponentLink5Description: https://datasheet.ciiva.com/16746/pyu-rc0402-51-rohs-l-6-r-16746831.pdf?src-supplier=Future+Electronics; Supplier 2: Mouser; Stock 2: 324625; Pricing 2: 1=0.10000, 10=0.01200, 100=0.00400, 1000=0.00400, 2500=0.00400, 10000=0.00300 (USD); Supplier 3: Farnell; Stock 3: 18234; Pricing 3: 1=0.08130, 25=0.01210, 100=0.01120, 250=0.01030, 500=0.00900 (GBP); Supplier Part Number 3: 2147864; Supplier Part Number 2: 603-RC0402FR-07220RL; Supplier Part Number 1: 311-220LRCT-ND; Created: D.G; Checked: ?
R15 = CRGP0805F100R: 100 Ohms ±1% 0.333W, 1/3W Chip Resistor 0805 (2012 Metric) Pulse Withstanding Thick Film; Manufacturer: TE Connectivity; Temperature Coefficient: 200ppm/°C; Supplier 1: Digi-Key; Manufacturer Part Number: CRGP0805F100R; RoHS: Yes; Category: Chip SMD Resistors; Stock 1: 6960; Pricing 1: 1=0.21000, 10=0.17600, 100=0.06870, 1000=0.02877, 2500=0.02637 (USD); Case/Package: 0805; Case Code (Imperial): 0805; Case Code (Metric): 2012; Min Operating Temperature: -55°C; Max Operating Temperature: 155°C; Resistor Type: Thick Film; Packaging: Cut Tape; Number of Terminations: 2; RoHS Compliant: Yes; ComponentLink1URL: https://www.te.com/commerce/DocumentDelivery/DDEController?Action=showdoc&DocId=Data+Sheet%7F9-1773463-9%7FA%7Fpdf%7FEnglish%7FENG_DS_9-1773463-9_A.pdf%7F1-2176327-3; ComponentLink1Description: Online datasheet; Supplier 2: Mouser; Stock 2: 4703; Pricing 2: 1=0.20000, 10=0.17500, 50=0.17500, 100=0.06800, 1000=0.02600, 10000=0.02000 (USD); Supplier 3: Farnell; Stock 3: 3670; Pricing 3: 10=0.14300, 100=0.06350, 500=0.04220, 1000=0.02090, 2500=0.01980, 5000=0.01650, 25000=0.01440 (GBP); Supplier Part Number 3: 2861083; Supplier Part Number 2: 279-CRGP0805F100R; Supplier Part Number 1: A130465CT-ND; Created By: D. Gakure; Checked By: ?
R16 = RC0402FR-07100KL: RES SMD 100K OHM 1% 1/16W 0402; Manufacturer: Yageo; Temperature Coefficient: 100ppm/°C; Power Rating: 63mW; Voltage Rating: 50V; Supplier 1: Digi-Key; Manufacturer Part Number: RC0402FR-07100KL; RoHS: Yes; Category: Resistors; Stock 1: 5819191; Pricing 1: 1=0.10000, 10=0.01400, 100=0.00580, 1000=0.00262, 2500=0.00228, 5000=0.00188 (USD); Case Code (Metric): 1005; Case Code (Imperial): 0402; Min Operating Temperature: -55°C; Max Operating Temperature: 155°C; Resistor Type: Thick Film; Packaging: Tape and Reel; Package Quantity: 1; Number of Terminations: 2; Termination: SMD/SMT; Max Power Dissipation: 63mW; Working Voltage: 50V; Features: Moisture Resistant; Length: 0.039inch; Height: 0.016inch; Width: 0.02inch; Depth: 0.5mm; REACH SVHC: No SVHC; Lead Free: Lead Free; Military Standard: Not; ComponentLink2URL: https://datasheet.ciiva.com/2453/pyu-r-int-thick-7-2453361.pdf; ComponentLink2Description: Online datasheet; Supplier 2: Mouser; Stock 2: 4458847; Pricing 2: 1=0.10000, 10=0.01200, 100=0.00400, 1000=0.00400, 2500=0.00400, 10000=0.00300 (USD); Supplier 3: Farnell; Stock 3: 19392; Pricing 3: 1=0.10200, 25=0.01220, 100=0.01200, 250=0.01020, 500=0.00890 (GBP); Created By: DG; Checked By: ?; Supplier Part Number 3: 2131798; Supplier Part Number 1: 311-100KLRCT-ND; Supplier Part Number 2: 603-RC0402FR-07100KL
SW1 = UK-B0267-SP25Y: SWITCH TACTILE SSPST 50mA @ 12VDC; Manufacturer: USAKRO; Operating Force: 3.9 N; Actuator: Oval; Contact Form: SPST; Switch Function: OFF - (ON); Product Category: Tactile Switches; RoHS: Details; Current Rating: 50 mA; Voltage Rating DC: 12 VDC; Mounting Style: SMD/SMT; Supplier 1: LCSC; ComponentLink1URL: https://datasheet.ciiva.com/18514/pts810-4mar13-18514167.pdf; ComponentLink1Description: Online datasheet; Supplier 1 Part Number: C493283; Manufacturer Part Number: UK-B0267-SP25Y
TP2-TP6 = TestPoint: Test Point
U1 = NCP114ASN330T1G: ON SEMICONDUCTOR - NCP114ASN330T1G - LDO Voltage Regulator, Fixed, 1.7 V to 5.5 V in, 3.3 V/300 mA out, 150 mV drop, TSOP-5; Output Current: 300mA; Output Configuration: Positive; Number of Regulators: 1; Max Input Voltage: 5.5V; Min Output Voltage: 3.3V; Dropout Voltage: 225mV; Quiescent Current: 95uA; Power Supply Rejection Ratio (PSRR): 75dB; Supplier 1: Digi-Key; RoHS: No; Category: Voltage Regulators - Linear; Stock 1: 32529; Pricing 1: 1=0.33000, 10=0.24900, 25=0.21760, 100=0.12440, 250=0.11664, 500=0.09330, 1000=0.07153 (USD); Mount: Surface Mount; Case/Package: SOT-23-5; Min Operating Temperature: -40°C; Max Operating Temperature: 85°C; Output Type: Fixed; Packaging: Cut Tape; Lead Free: Lead Free; ComponentLink3URL: http://www.onsemi.com/pub/Collateral/NCP114-D.PDF; ComponentLink3Description: On Semi datasheet online; Supplier 2: RSComponents; Supplier 3: Mouser; Supplier Part Number 3: 863-NCP114ASN330T1G; Supplier Part Number 2: 1263178; Supplier Part Number 1: NCP114ASN330T1GOSCT-ND; Created: DG; Checked: ?; Manufacturer: ON Semiconductor; Manufacturer Part Number: NCP114ASN330T1G
U2 = TPS2553DBVR: IC PWR SWITCH N-CHAN 1:1 SOT23-6; Manufacturer: Texas Instruments; Number of Outputs: 1; Min Supply Voltage: 2.5V; Max Supply Voltage: 6.5V; On-State Resistance: 85mR; Output Current: 1.5A; Max Power Dissipation: 625mW; Supplier 1: Digi-Key; RoHS: Yes; Category: Hot Swap Controllers; Stock 1: 14713; Pricing 1: 1=1.20000, 10=1.07100, 25=1.01640, 100=0.78050, 250=0.68972, 500=0.65340, 1000=0.50820 (USD); Case/Package: SOT-23; Number of Pins: 6; Weight: 0.00127oz; Min Operating Temperature: -40°C; Max Operating Temperature: 85°C; Packaging: Tape and Reel; Package Quantity: 1; Max Input Voltage: 6.5V; Min Input Voltage: 2.5V; Radiation Hardening: No; Lead Free: Lead Free; REACH SVHC: No SVHC; ComponentLink1URL: https://datasheet.ciiva.com/15108/getdatasheetpartid-297517-15108509.pdf; ComponentLink1Description: Online datasheet; Supplier 2: Farnell; Supplier 3: Mouser; Supplier Part Number 3: 595-TPS2553DBVR; Supplier Part Number 2: 3124082; Supplier Part Number 1: 296-32464-1-ND; Manufacturer Part Number: TPS2553DBVR
U4 = BM833: Supplier 1: Digi-Key; Manufacturer 1: Fanstel; RoHS: No; Category: RF Receivers, Transceivers; Stock 1: 879; Pricing 1: 1=10.43000, 10=9.55900, 25=8.69000, 100=7.82100, 250=7.16924, 500=6.51750 (USD); Supplier 2: Mouser; Supplier Part Number 2: 308-BM833; Supplier Part Number 1: 1914-BM833CT-ND; ComponentLink1Description: Datasheet (offline); ComponentLink1URL: Y:\System\Altium\Libraries 2014\Fanstel\Datasheets\BM833_datasheets.pdf; ComponentLink2Description: Datasheet (online); ComponentLink2URL: https://www.fanstel.com/s/BM833_datasheets-rs9l.pdf; Manufacturer Part Number 1: BM833

## Assembly variants
JLCPCB: alternate parts D2 -> RB161MM-20TR, R1 -> 0402WGF1004TCE, R2 -> 0402WGF3303TCE, R6 -> 0402WGF5232TCE, R7 -> RT0402FRE0768KL, R8 -> 0402WGF1004TCE